# Altium project EncoderArm.PrjPcb
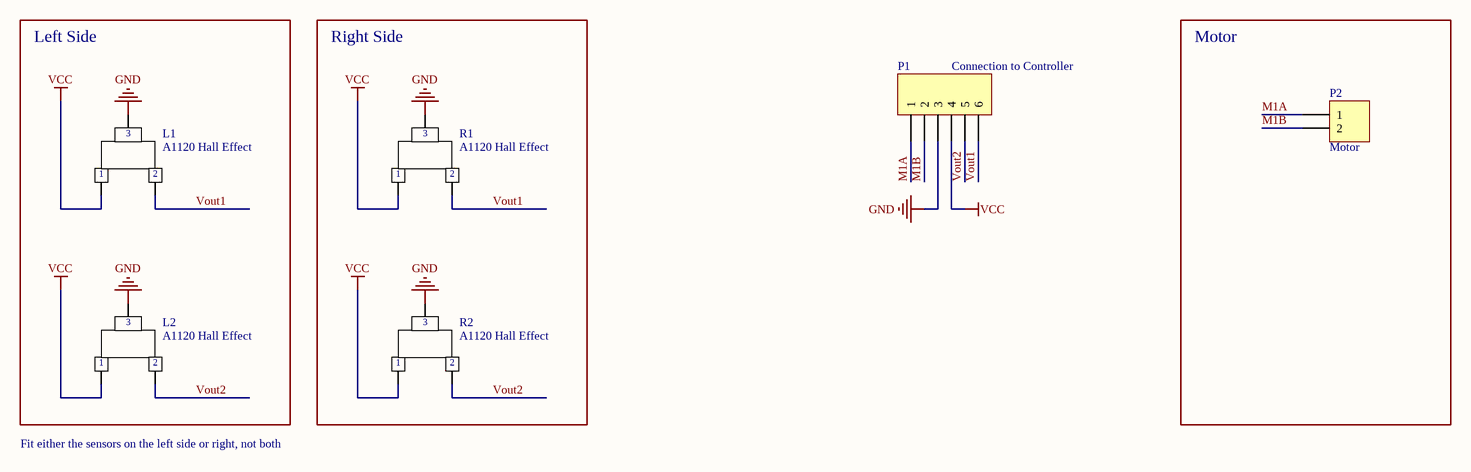
[diagram p0: EncoderArm.SchDoc]
1 sheet, 6 parts. Net scope: global (net labels, ports and power ports of the same name join across sheets).
Board file: EncoderArm.PcbDoc

## Sheet EncoderArm.SchDoc
size A4

### Parts
L1  A1120 Hall Effect  [SOT23-3N]
L2  A1120 Hall Effect  [SOT23-3N]
P1  Connection to Controller  [HDR1X6]
P2  Motor  [HDR1X2]
R1  A1120 Hall Effect  [SOT23-3N]
R2  A1120 Hall Effect  [SOT23-3N]

### Blocks framed on the sheet
Left Side: L1 L2
Right Side: R1 R2
Motor: P2

### Nets
GND: L1.3 L2.3 P1.3 R1.3 R2.3
VCC: L1.1 L2.1 P1.4 R1.1 R2.1
M1A: P1.1 P2.1
M1B: P1.2 P2.2
Vout1: L1.2 P1.6 R1.2
Vout2: L2.2 P1.5 R2.2

### Notes on the sheet
- Fit either the sensors on the left side or right, not both

### Library data of the parts
L1 L2 R1 R2 = FT_SOT23-3
P1 = Header 6: Header, 6-Pin; LatestRevisionDate: 17-Jul-2002; LatestRevisionNote: Re-released for DXP Platform.; Publisher: Altium Limited
P2 = Header 2: Header, 2-Pin; LatestRevisionDate: 17-Jul-2002; LatestRevisionNote: Re-released for DXP Platform.; Publisher: Altium Limited